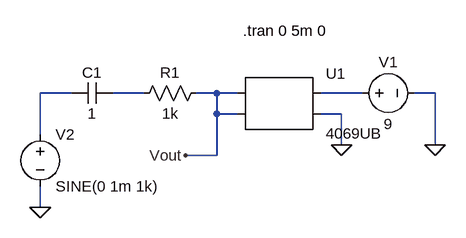
[diagram p0: schematic Q2.2.asc]
Q2.2.asc, the LTspice schematic file:
Version 4
SHEET 1 880 680
WIRE 80 256 32 256
WIRE 192 256 144 256
WIRE 304 256 272 256
WIRE 336 256 304 256
WIRE 528 256 464 256
WIRE 640 256 608 256
WIRE 304 288 304 256
WIRE 336 288 304 288
WIRE 496 288 464 288
WIRE 32 320 32 256
WIRE 496 336 496 288
WIRE 640 336 640 256
WIRE 304 352 304 288
WIRE 304 352 256 352
WIRE 32 432 32 400
FLAG 32 432 0
FLAG 496 336 0
FLAG 640 336 0
FLAG 256 352 Vout
SYMBOL AutoGenerated/4069UB 400 272 R0
SYMATTR InstName U1
SYMBOL voltage 512 256 R270
WINDOW 0 32 56 VTop 2
WINDOW 3 -32 56 VBottom 2
SYMATTR InstName V1
SYMATTR Value 9
SYMBOL voltage 32 304 R0
SYMATTR InstName V2
SYMATTR Value SINE(0 1m 1k)
SYMBOL cap 144 240 R90
WINDOW 0 0 32 VBottom 2
WINDOW 3 32 32 VTop 2
SYMATTR InstName C1
SYMATTR Value 1
SYMBOL res 176 272 R270
WINDOW 0 32 56 VTop 2
WINDOW 3 0 56 VBottom 2
SYMATTR InstName R1
SYMATTR Value 1k
TEXT 344 160 Left 2 !.tran 0 5m 0

The netlist it stands for:
* Q2.2.asc
* U1: 4069UB (symbol AutoGenerated/4069UB not available, pins judged from their places): pin1=Vout pin2=Vout pin3=N003 pin4=0
V1 N003 0 9
V2 N001 0 SINE(0 1m 1k)
C1 N002 N001 1
R1 N002 Vout 1k
.tran 0 5m 0
.backanno
.end